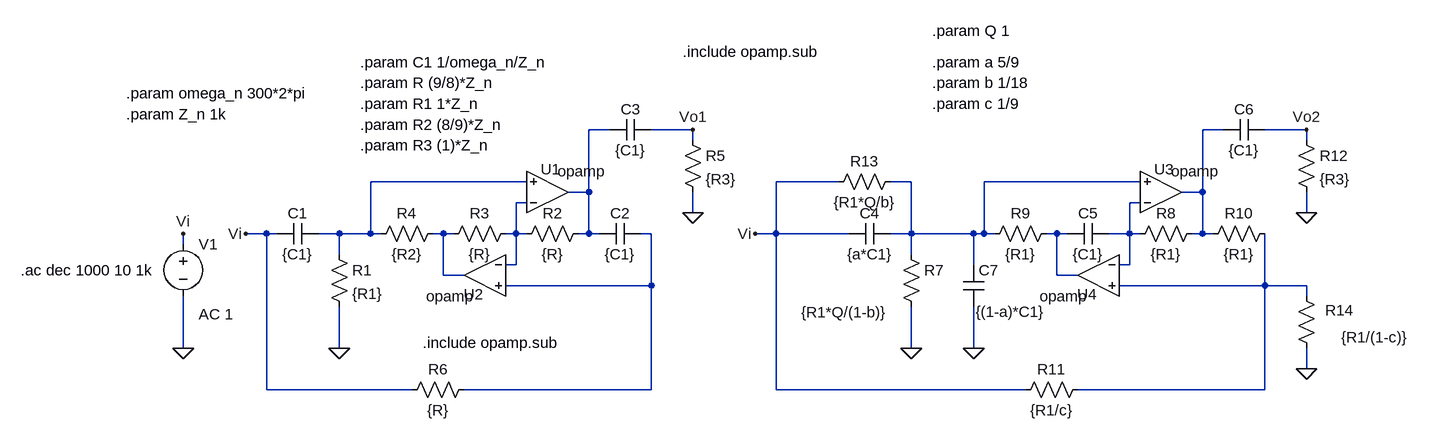
[diagram p0: schematic sim.asc]
sim.asc, the LTspice schematic file:
Version 4
SHEET 1 1928 680
WIRE 624 -16 592 -16
WIRE 752 -16 688 -16
WIRE 1568 -16 1536 -16
WIRE 1696 -16 1632 -16
WIRE 752 0 752 -16
WIRE 1696 0 1696 -16
WIRE 496 64 256 64
WIRE 976 64 880 64
WIRE 1088 64 1056 64
WIRE 1440 64 1200 64
WIRE 592 80 592 -16
WIRE 592 80 560 80
WIRE 1536 80 1536 -16
WIRE 1536 80 1504 80
WIRE 496 96 480 96
WIRE 1440 96 1424 96
WIRE 752 112 752 80
WIRE 1696 112 1696 80
WIRE 96 144 64 144
WIRE 112 144 96 144
WIRE 208 144 176 144
WIRE 256 144 256 64
WIRE 256 144 208 144
WIRE 272 144 256 144
WIRE 368 144 352 144
WIRE 384 144 368 144
WIRE 480 144 480 96
WIRE 480 144 464 144
WIRE 496 144 480 144
WIRE 592 144 592 80
WIRE 592 144 576 144
WIRE 608 144 592 144
WIRE 688 144 672 144
WIRE 880 144 880 64
WIRE 880 144 848 144
WIRE 992 144 880 144
WIRE 1088 144 1088 64
WIRE 1088 144 1056 144
WIRE 1184 144 1088 144
WIRE 1200 144 1200 64
WIRE 1200 144 1184 144
WIRE 1216 144 1200 144
WIRE 1312 144 1296 144
WIRE 1328 144 1312 144
WIRE 1424 144 1424 96
WIRE 1424 144 1392 144
WIRE 1440 144 1424 144
WIRE 1536 144 1536 80
WIRE 1536 144 1520 144
WIRE 1552 144 1536 144
WIRE -32 160 -32 144
WIRE 208 176 208 144
WIRE 1088 176 1088 144
WIRE 480 192 480 144
WIRE 480 192 464 192
WIRE 1184 192 1184 144
WIRE 1424 192 1424 144
WIRE 1424 192 1408 192
WIRE 368 208 368 144
WIRE 400 208 368 208
WIRE 1312 208 1312 144
WIRE 1344 208 1312 208
WIRE 688 224 688 144
WIRE 688 224 464 224
WIRE 1632 224 1632 144
WIRE 1632 224 1408 224
WIRE 1696 224 1632 224
WIRE 1696 240 1696 224
WIRE -32 320 -32 240
WIRE 208 320 208 256
WIRE 1088 320 1088 256
WIRE 1184 320 1184 256
WIRE 1696 352 1696 320
WIRE 96 384 96 144
WIRE 320 384 96 384
WIRE 688 384 688 224
WIRE 688 384 400 384
WIRE 880 384 880 144
WIRE 1264 384 880 384
WIRE 1632 384 1632 224
WIRE 1632 384 1344 384
FLAG 208 320 0
FLAG -32 320 0
FLAG -32 144 Vi
FLAG 64 144 Vi
FLAG 752 112 0
FLAG 752 -16 Vo1
FLAG 1088 320 0
FLAG 848 144 Vi
FLAG 1696 112 0
FLAG 1696 -16 Vo2
FLAG 1184 320 0
FLAG 1696 352 0
SYMBOL voltage -32 144 R0
WINDOW 123 24 124 Left 2
WINDOW 39 0 0 Left 0
SYMATTR InstName V1
SYMATTR Value ""
SYMATTR Value2 AC 1
SYMBOL cap 176 128 R90
WINDOW 0 0 32 VBottom 2
WINDOW 3 32 32 VTop 2
SYMATTR InstName C1
SYMATTR Value {C1}
SYMBOL res 192 160 R0
SYMATTR InstName R1
SYMATTR Value {R1}
SYMBOL OpAmps\\opamp 528 144 M180
WINDOW 0 -10 99 Left 2
SYMATTR InstName U1
SYMBOL OpAmps\\opamp 432 144 M0
WINDOW 0 2 93 Left 2
SYMATTR InstName U2
SYMBOL res 592 128 R90
WINDOW 0 0 56 VBottom 2
WINDOW 3 32 56 VTop 2
SYMATTR InstName R2
SYMATTR Value {R}
SYMBOL res 480 128 R90
WINDOW 0 0 56 VBottom 2
WINDOW 3 32 56 VTop 2
SYMATTR InstName R3
SYMATTR Value {R}
SYMBOL res 368 128 R90
WINDOW 0 0 56 VBottom 2
WINDOW 3 32 56 VTop 2
SYMATTR InstName R4
SYMATTR Value {R2}
SYMBOL cap 672 128 R90
WINDOW 0 0 32 VBottom 2
WINDOW 3 32 32 VTop 2
SYMATTR InstName C2
SYMATTR Value {C1}
SYMBOL res 416 368 R90
WINDOW 0 0 56 VBottom 2
WINDOW 3 32 56 VTop 2
SYMATTR InstName R6
SYMATTR Value {R}
SYMBOL cap 688 -32 R90
WINDOW 0 0 32 VBottom 2
WINDOW 3 32 32 VTop 2
SYMATTR InstName C3
SYMATTR Value {C1}
SYMBOL res 736 -16 R0
SYMATTR InstName R5
SYMATTR Value {R3}
SYMBOL cap 1056 128 R90
WINDOW 0 0 32 VBottom 2
WINDOW 3 32 32 VTop 2
SYMATTR InstName C4
SYMATTR Value {a*C1}
SYMBOL res 1072 160 R0
WINDOW 3 -153 105 Left 2
SYMATTR InstName R7
SYMATTR Value {R1*Q/(1-b)}
SYMBOL OpAmps\\opamp 1472 144 M180
WINDOW 0 -10 99 Left 2
SYMATTR InstName U3
SYMBOL OpAmps\\opamp 1376 144 M0
WINDOW 0 2 93 Left 2
SYMATTR InstName U4
SYMBOL res 1536 128 R90
WINDOW 0 0 56 VBottom 2
WINDOW 3 32 56 VTop 2
SYMATTR InstName R8
SYMATTR Value {R1}
SYMBOL res 1312 128 R90
WINDOW 0 0 56 VBottom 2
WINDOW 3 32 56 VTop 2
SYMATTR InstName R9
SYMATTR Value {R1}
SYMBOL res 1648 128 R90
WINDOW 0 0 56 VBottom 2
WINDOW 3 32 56 VTop 2
SYMATTR InstName R10
SYMATTR Value {R1}
SYMBOL cap 1392 128 R90
WINDOW 0 0 32 VBottom 2
WINDOW 3 32 32 VTop 2
SYMATTR InstName C5
SYMATTR Value {C1}
SYMBOL res 1360 368 R90
WINDOW 0 0 56 VBottom 2
WINDOW 3 32 56 VTop 2
SYMATTR InstName R11
SYMATTR Value {R1/c}
SYMBOL cap 1632 -32 R90
WINDOW 0 0 32 VBottom 2
WINDOW 3 32 32 VTop 2
SYMATTR InstName C6
SYMATTR Value {C1}
SYMBOL res 1680 -16 R0
SYMATTR InstName R12
SYMATTR Value {R3}
SYMBOL res 1072 48 R90
WINDOW 0 0 56 VBottom 2
WINDOW 3 32 56 VTop 2
SYMATTR InstName R13
SYMATTR Value {R1*Q/b}
SYMBOL cap 1168 192 R0
WINDOW 3 19 72 Left 2
SYMATTR InstName C7
SYMATTR Value {(1-a)*C1}
SYMBOL res 1712 336 R180
WINDOW 0 -57 74 Left 2
WINDOW 3 -142 33 Left 2
SYMATTR InstName R14
SYMATTR Value {R1/(1-c)}
TEXT -120 -72 Left 2 !.param omega_n 300*2*pi
TEXT -120 -40 Left 2 !.param Z_n 1k
TEXT 240 -120 Left 2 !.param C1 1/omega_n/Z_n
TEXT 240 -88 Left 2 !.param R (9/8)*Z_n
TEXT 240 -56 Left 2 !.param R1 1*Z_n
TEXT 240 -24 Left 2 !.param R2 (8/9)*Z_n
TEXT -282 200 Left 2 !.ac dec 1000 10 1k
TEXT 336 312 Left 2 !.include opamp.sub
TEXT 240 8 Left 2 !.param R3 (1)*Z_n
TEXT 1120 -120 Left 2 !.param a 5/9
TEXT 736 -136 Left 2 !.include opamp.sub
TEXT 1120 -88 Left 2 !.param b 1/18
TEXT 1120 -56 Left 2 !.param c 1/9
TEXT 1120 -168 Left 2 !.param Q 1

The netlist it stands for:
* sim.asc
V1 Vi 0 AC 1
C1 N003 Vi {C1}
R1 N003 0 {R1}
XU1 N005 N003 N001 opamp Aol=100K GBW=10Meg  ; pins invin noninvin out
XU2 N005 N008 N007 opamp Aol=100K GBW=10Meg  ; pins invin noninvin out
R2 N001 N005 {R}
R3 N005 N007 {R}
R4 N007 N003 {R2}
C2 N008 N001 {C1}
R6 N008 Vi {R}
C3 Vo1 N001 {C1}
R5 Vo1 0 {R3}
C4 N004 Vi {a*C1}
R7 N004 0 {R1*Q/(1-b)}
XU3 N006 N004 N002 opamp Aol=100K GBW=10Meg  ; pins invin noninvin out
XU4 N006 N010 N009 opamp Aol=100K GBW=10Meg  ; pins invin noninvin out
R8 N002 N006 {R1}
R9 N009 N004 {R1}
R10 N010 N002 {R1}
C5 N006 N009 {C1}
R11 N010 Vi {R1/c}
C6 Vo2 N002 {C1}
R12 Vo2 0 {R3}
R13 N004 Vi {R1*Q/b}
C7 N004 0 {(1-a)*C1}
R14 0 N010 {R1/(1-c)}
.param omega_n 300*2*pi
.param Z_n 1k
.param C1 1/omega_n/Z_n
.param R (9/8)*Z_n
.param R1 1*Z_n
.param R2 (8/9)*Z_n
.ac dec 1000 10 1k
.include opamp.sub
.param R3 (1)*Z_n
.param a 5/9
.include opamp.sub
.param b 1/18
.param c 1/9
.param Q 1
.backanno
.end